# Altium schematic sheet ANA_SWITCH.SchDoc
size 420 x 297 mm; SheetNumber: 33; SheetTotal: 33
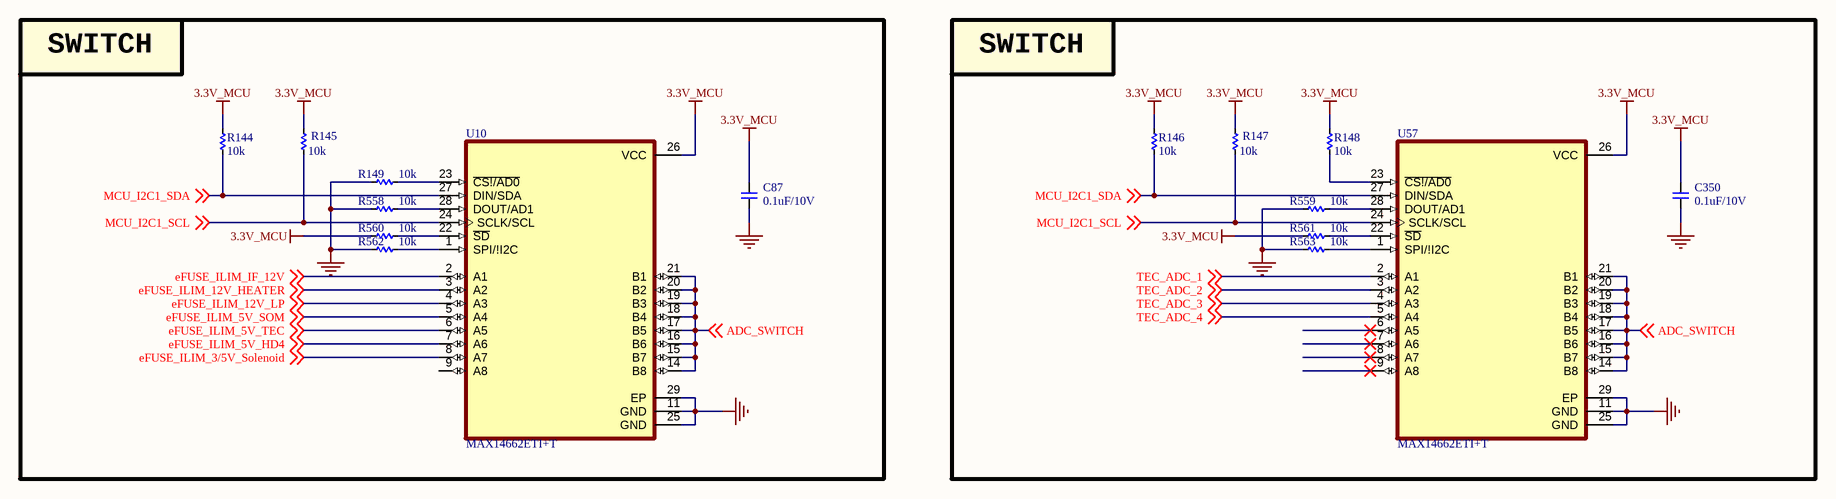
[diagram p0: ANA_SWITCH.SchDoc]

## Parts
C87  0.1uF/10V  [CAP_C_1005X50_L]
C350  0.1uF/10V  [CAP_C_1005X50_L]
R144  10k  [RES_C_1005x30_L]
R145  10k  [RES_C_1005x30_L]
R146  10k  [RES_C_1005x30_L]
R147  10k  [RES_C_1005x30_L]
R148  10k  [RES_C_1005x30_L]
R149  10k  [RES_C_1005x30_L]
R558  10k  [RES_C_1005x30_L]
R559  10k  [RES_C_1005x30_L]
R560  10k  [RES_C_1005x30_L]
R561  10k  [RES_C_1005x30_L]
R562  10k  [RES_C_1005x30_L]
R563  10k  [RES_C_1005x30_L]
U10  MAX14662ETI+T  [QFN40P400X400X80-29N]
U57  MAX14662ETI+T  [QFN40P400X400X80-29N]

## Blocks framed on the sheet
SWITCH: C87 R144 R145 R149 R558 R560 R562 U10
SWITCH: C350 R146-R148 R559 R561 R563 U57

## Nets
3.3V_MCU: C87.2 C350.2 R144.2 R145.2 R146.2 R147.2 R148.1 R560.1 R561.1 U10.26(VCC) U57.26(VCC)
GND: C87.1 C350.1 R149.1 R558.1 R559.1 R562.1 R563.1 U10.11(GND) U10.25(GND) U10.29(EP) U57.11(GND) U57.25(GND) U57.29(EP)
ADC_SWITCH: U10.14(B8) U10.15(B7) U10.16(B6) U10.17(B5) U10.18(B4) U10.19(B3) U10.20(B2) U10.21(B1) U57.14(B8) U57.15(B7) U57.16(B6) U57.17(B5) U57.18(B4) U57.19(B3) U57.20(B2) U57.21(B1) ; off-sheet ADC_SWITCH
eFUSE_ILIM_3/5V_Solenoid: U10.8(A7) ; off-sheet eFUSE_ILIM_3/5V_Solenoid
eFUSE_ILIM_5V_HD4: U10.7(A6) ; off-sheet eFUSE_ILIM_5V_HD4
eFUSE_ILIM_5V_SOM: U10.5(A4) ; off-sheet eFUSE_ILIM_5V_SOM
eFUSE_ILIM_5V_TEC: U10.6(A5) ; off-sheet eFUSE_ILIM_5V_TEC
eFUSE_ILIM_12V_HEATER: U10.3(A2) ; off-sheet eFUSE_ILIM_12V_HEATER
eFUSE_ILIM_12V_LP: U10.4(A3) ; off-sheet eFUSE_ILIM_12V_LP
eFUSE_ILIM_IF_12V: U10.2(A1) ; off-sheet eFUSE_ILIM_IF_12V
MCU_I2C1_SCL: R145.1 R147.1 U10.24(SCLK/SCL) U57.24(SCLK/SCL) ; off-sheet MCU_I2C1_SCL
MCU_I2C1_SDA: R144.1 R146.1 U10.27(DIN/SDA) U57.27(DIN/SDA) ; off-sheet MCU_I2C1_SDA
TEC_ADC_1: U57.2(A1) ; off-sheet TEC_ADC_1
TEC_ADC_2: U57.3(A2) ; off-sheet TEC_ADC_2
TEC_ADC_3: U57.4(A3) ; off-sheet TEC_ADC_3
TEC_ADC_4: U57.5(A4) ; off-sheet TEC_ADC_4
NetR148_2: R148.2 U57.23(~{CS!/AD0})
NetR149_2: R149.2 U10.23(~{CS!/AD0})
NetR558_2: R558.2 U10.28(DOUT/AD1)
NetR559_2: R559.2 U57.28(DOUT/AD1)
NetR560_2: R560.2 U10.22(~{SD})
NetR561_2: R561.2 U57.22(~{SD})
NetR562_2: R562.2 U10.1(SPI/!I2C)
NetR563_2: R563.2 U57.1(SPI/!I2C)

Not connected (* = marked no-connect by the designer): U10 9(A8); U57 6(A5)* 7(A6)* 8(A7)* 9(A8)*

## Notes on the sheet
- Project:
- BEE-1012
- Sub-system:
- SATELLITE_EXP_CONTROLLER
- Design by:
- SANG HUYNH
- BAO BUI
- Sheet title:
- Sheet
- A3
- of
- Checked by:
- Approved by:
- VU PHAM
- Revision:
- Document No:
- Size:
- Date:

## Library data of the parts
C87 C350 = _CAP_C_2: CAP
R144-R149 R558-R563 = _RES_B_2: RES
U10 U57 = IC_SW_MAX14662ETI+T: 8 Circuit IC Switch 1:1 1Ohm 28-TQFN _4x4_; MF: Maxim Integrated; Package: TQFN-28 Maxim; Value: *; Price: None; MP: MAX14662ETI+T; SnapEDA_Link: https://www.snapeda.com/parts/MAX14662ETI%2BT/Maxim%20Integrated/view-part/546683/?ref=snap; Availability: Unavailable